# EAGLE design test (EAGLE 7.2.0)
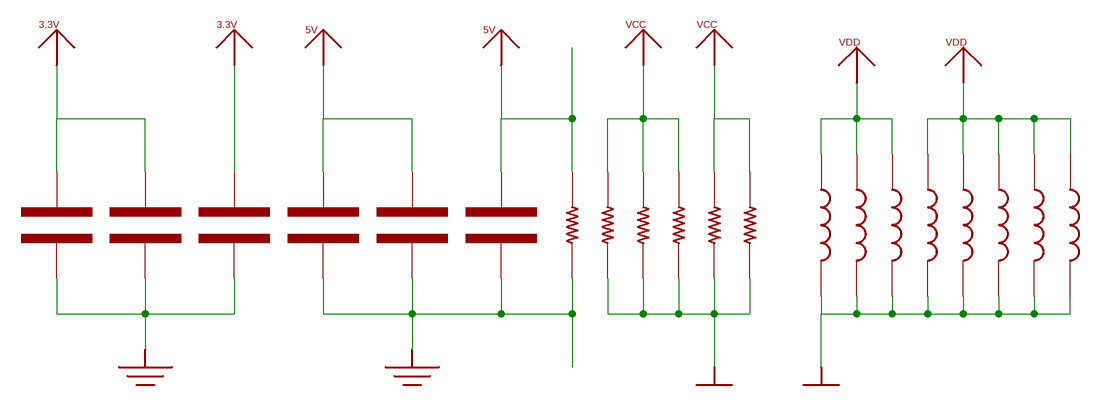
[diagram p0: schematic, sheet 1]

## Parts
C1  CAP-0402  [0402-CAP]
C2  CAP-0402  [0402-CAP]
C3  CAP-0603  [0603-CAP]
C4  CAP-0603  [0603-CAP]
C5  CAP-0805  [0805]
C6  CAP-0805  [0805]
L1  IND-0402  [0402-CAP]
L2  IND-0402  [0402-CAP]
L3  IND-0603  [0603-CAP]
L4  IND-0603  [0603-CAP]
L5  IND-0805  [0805]
L6  IND-0805  [0805]
L7  IND-1206  [1206]
L8  IND-1206  [1206]
R1  RES-0402  [0402-RES]
R2  RES-0402  [0402-RES]
R3  RES-0603  [0603-RES]
R4  RES-0603  [0603-RES]
R5  RES-0805  [0805]
R6  RES-0805  [0805]

## Nets
3.3V: C1.1 C2.1 C3.1
5V: C4.1 C5.1 C6.1 R1.1
GND: C1.2 C2.2 C3.2 C4.2 C5.2 C6.2 R1.2
VCC: R2.1 R3.1 R4.1 R5.1 R6.1
VDD: L1.1 L2.1 L3.1 L4.1 L5.1 L6.1 L7.1 L8.1
VSS: L1.2 L2.2 L3.2 L4.2 L5.2 L6.2 L7.2 L8.2 R2.2 R3.2 R4.2 R5.2 R6.2

## Library data of the parts
C1 C2 = iffy:CAP-0402
C3 C4 = iffy:CAP-0603
C5 C6 = iffy:CAP-0805
L1 L2 = iffy:IND-0402
L3 L4 = iffy:IND-0603
L5 L6 = iffy:IND-0805
L7 L8 = iffy:IND-1206
R1 R2 = iffy:RES-0402
R3 R4 = iffy:RES-0603
R5 R6 = iffy:RES-0805

## Board
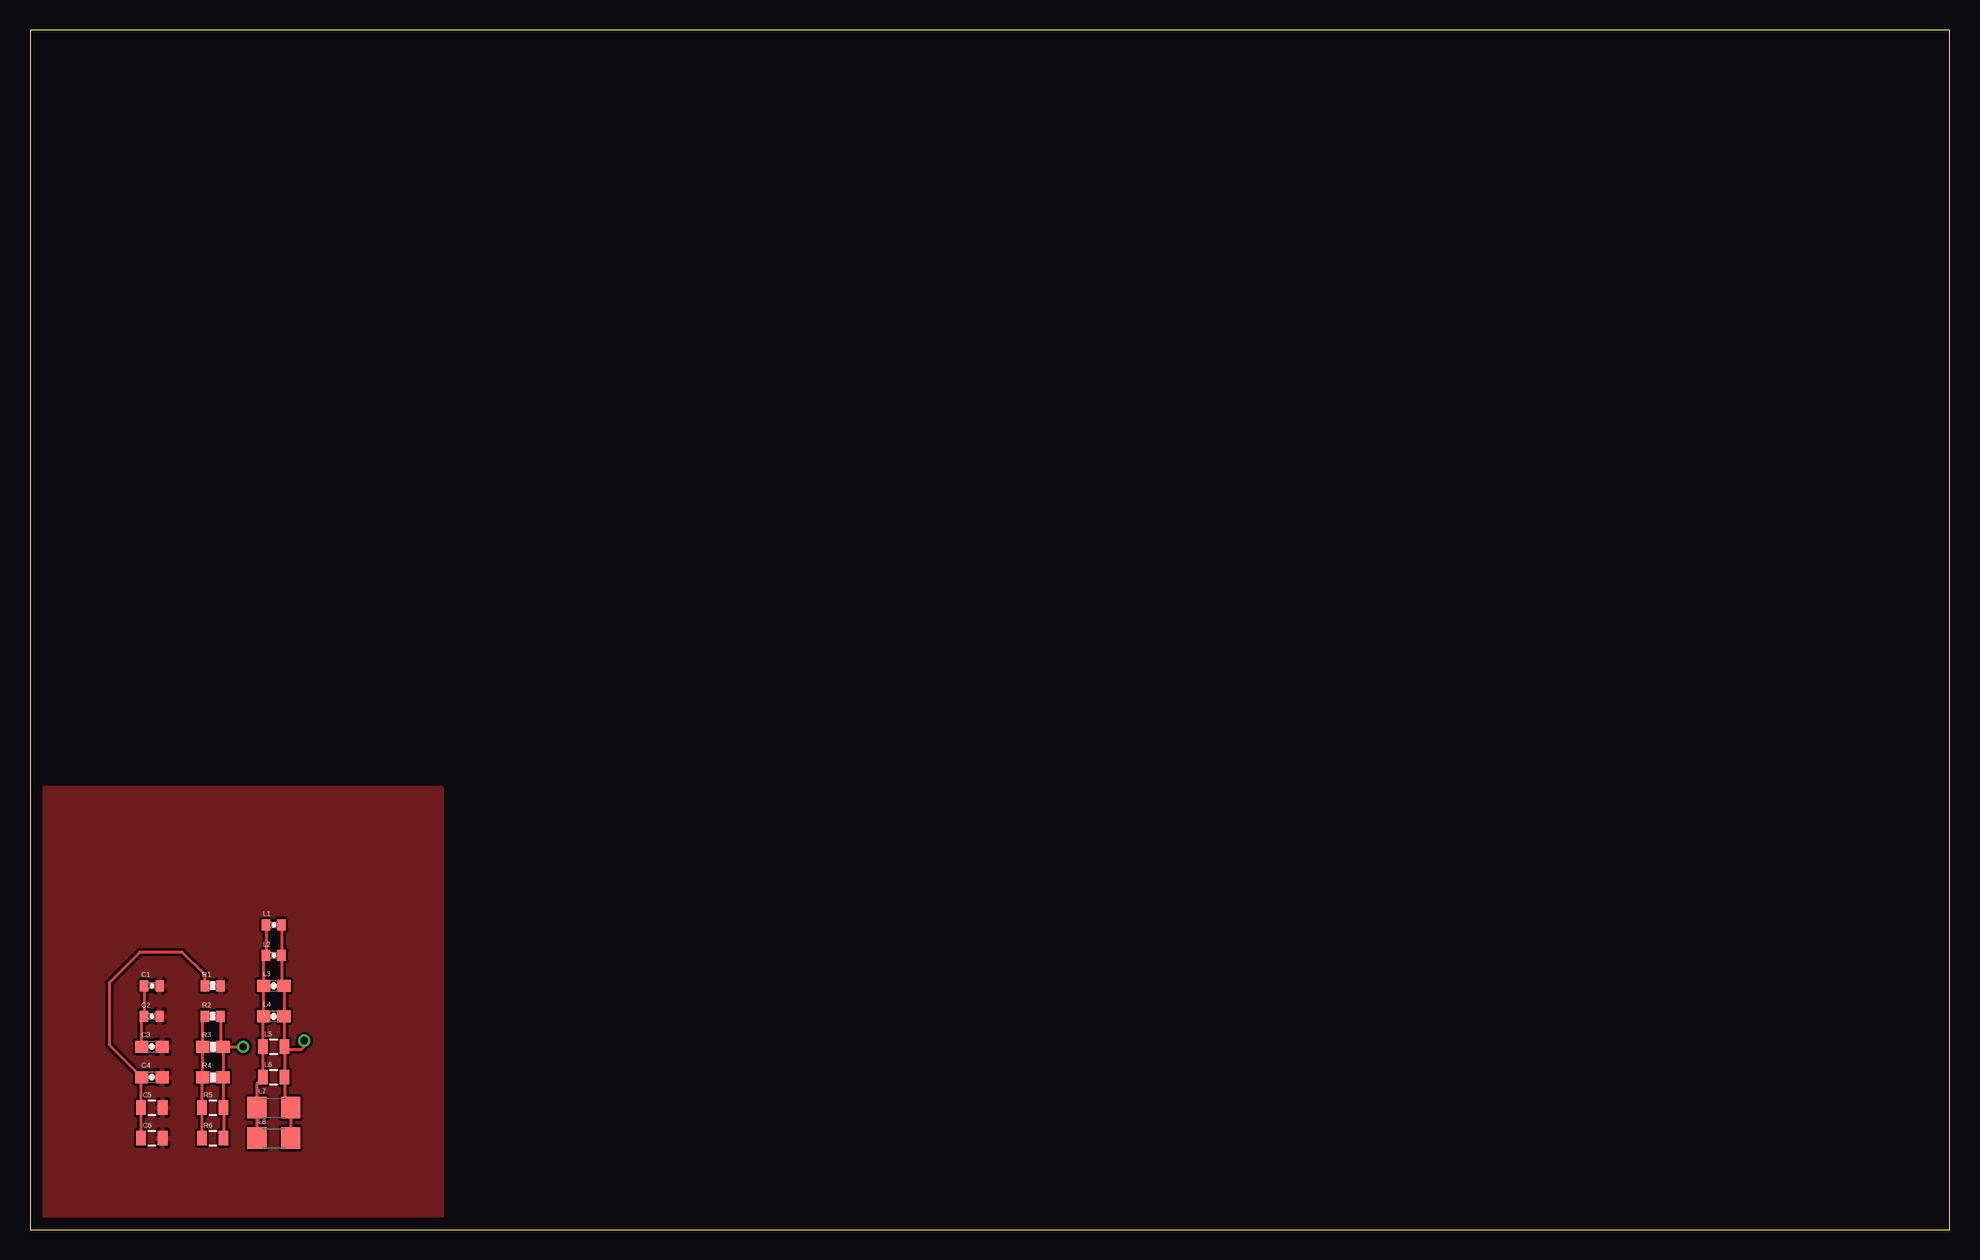
[diagram p1: board, top side]
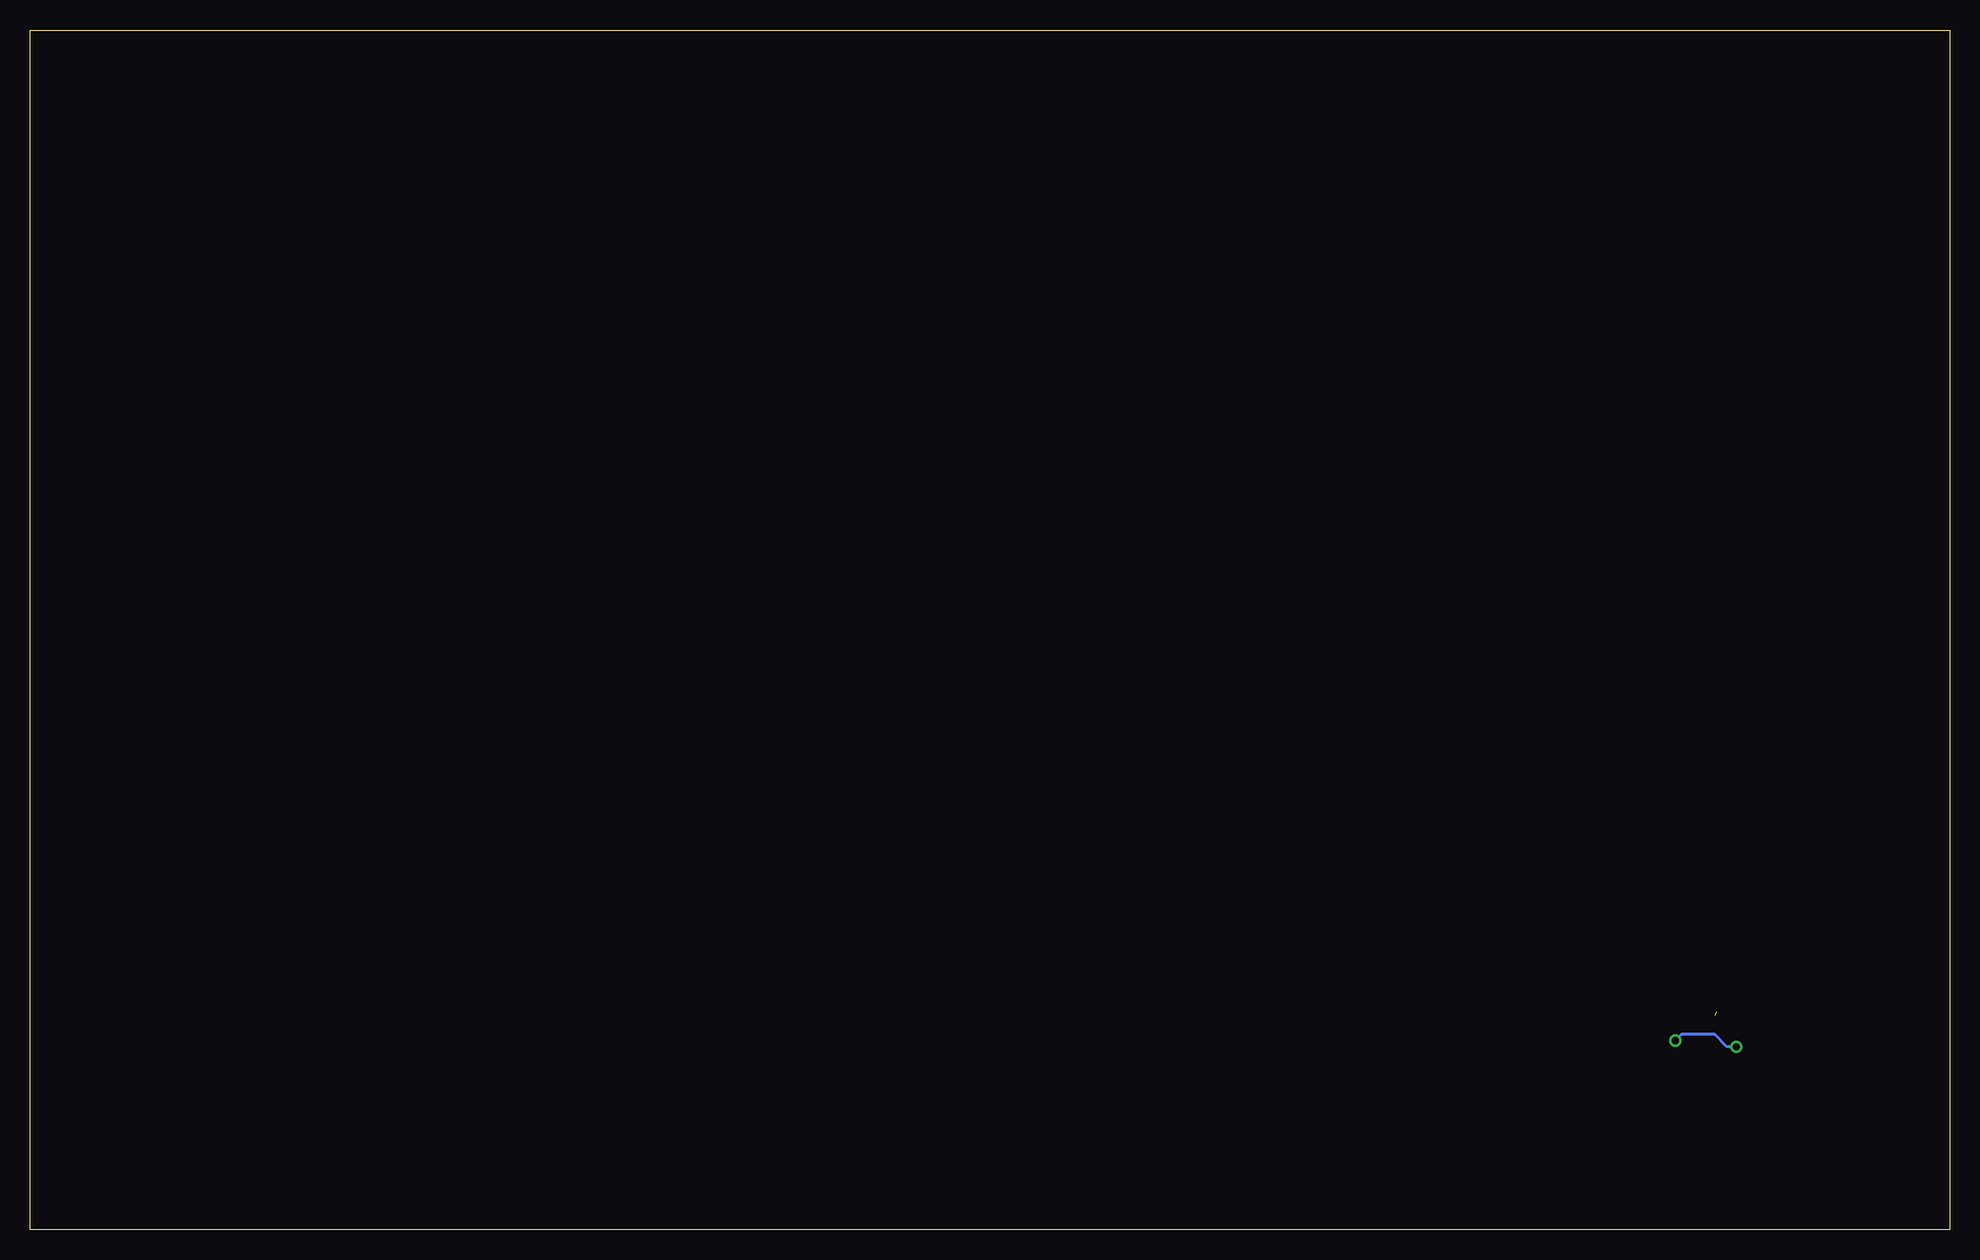
[diagram p2: board, bottom side, seen from below]

Size 160 x 100 mm. Coordinates in mm from the lower left corner, seen from the top.
Outline: 0,0 160,0 160,100 0,100 0,0
Copper layers (1*16): Top 0.035mm / dielectric 1.5mm / Bottom 0.035mm
Design rules "default": minimum track width 10mil, minimum drill 24mil, track to track 8mil, track to pad 8mil, pad to pad 8mil, via to via 8mil, smd to smd 8mil, copper to edge 40mil, drill to drill 8mil, minimum pad ring 10mil, minimum via ring 8mil, stop-mask expansion 4mil, vias tented up to drill 0mil, thermal gap 10mil

### Footprints (pad centres in the part's own frame; a part is rotated, then mirrored left to right if it is on the bottom)
0402-CAP = smd 0.7 x 0.9: 1 -0.65,0; 2 0.65,0
0603-CAP = smd 1.1 x 1: 1 -0.85,0; 2 0.85,0
0805 = smd 0.8 x 1.2: 1 -0.9,0; 2 0.9,0
1206 = smd 1.6 x 1.8: 1 -1.4,0; 2 1.4,0
0402-RES = smd 0.7 x 0.9: 1 -0.65,0; 2 0.65,0
0603-RES = smd 1.1 x 1: 1 -0.85,0; 2 0.85,0

### Placement (x,y rotation side)
C1  10.16,20.32 0 top
C2  10.16,17.78 0 top
C3  10.16,15.24 0 top
C4  10.16,12.7 0 top
C5  10.16,10.16 0 top
C6  10.16,7.62 0 top
L1  20.32,25.4 0 top
L2  20.32,22.86 0 top
L3  20.32,20.32 0 top
L4  20.32,17.78 0 top
L5  20.32,15.24 0 top
L6  20.32,12.7 0 top
L7  20.32,10.16 0 top
L8  20.32,7.62 0 top
R1  15.24,20.32 0 top
R2  15.24,17.78 0 top
R3  15.24,15.24 0 top
R4  15.24,12.7 0 top
R5  15.24,10.16 0 top
R6  15.24,7.62 0 top

### Tracks (layer width: path | path; a pad name or v marks a point on that pad's centre or on a via)
3.3V
  Top 0.254: C3.1 9.31,17.58 C2.1 C1.1
5V
  Top 0.254: R1.1 14.59,21.22 12.7,23.11 9.14,23.11 6.6,20.57 6.6,15.41 C4.1 9.26,12.65 C5.1 C6.1
GND
  pour Top: -11.43,36.83 34.29,36.83 34.29,-12.7 -11.43,-12.7
VCC
  Top 0.254: R6.1 R5.1 14.34,12.65 R4.1 R3.1 14.39,17.58 R2.1
VDD  (1 unrouted)
  Top 0.254: L8.1 L7.1 18.92,12.2 L6.1 L5.1 19.42,18.15 | 19.56,17.87 L4.1 L3.1 19.47,22.66 L2.1 L1.1
VSS  (via drill 0.6)
  Top 0.254: L1.2 L2.2 20.97,20.52 L3.2 L4.2 21.17,15.29 L5.2 | L5.2 L6.2 21.22,10.66 L7.2 L8.2 | R2.2 15.89,15.44 R3.2 | R3.2 R4.2 16.09,9.74 16,9.65 16,10.02 R5.2 R6.2 | R3.2 v17.78,15.24 | v22.86,15.75 22.86,15.24 22.61,14.99 21.47,14.99 L5.2
  Bottom 0.254: v17.78,15.24 18.54,15.24 19.56,16.26 22.35,16.26 v22.86,15.75